# EAGLE design PRoMo_Base_DIP (EAGLE 6.4)
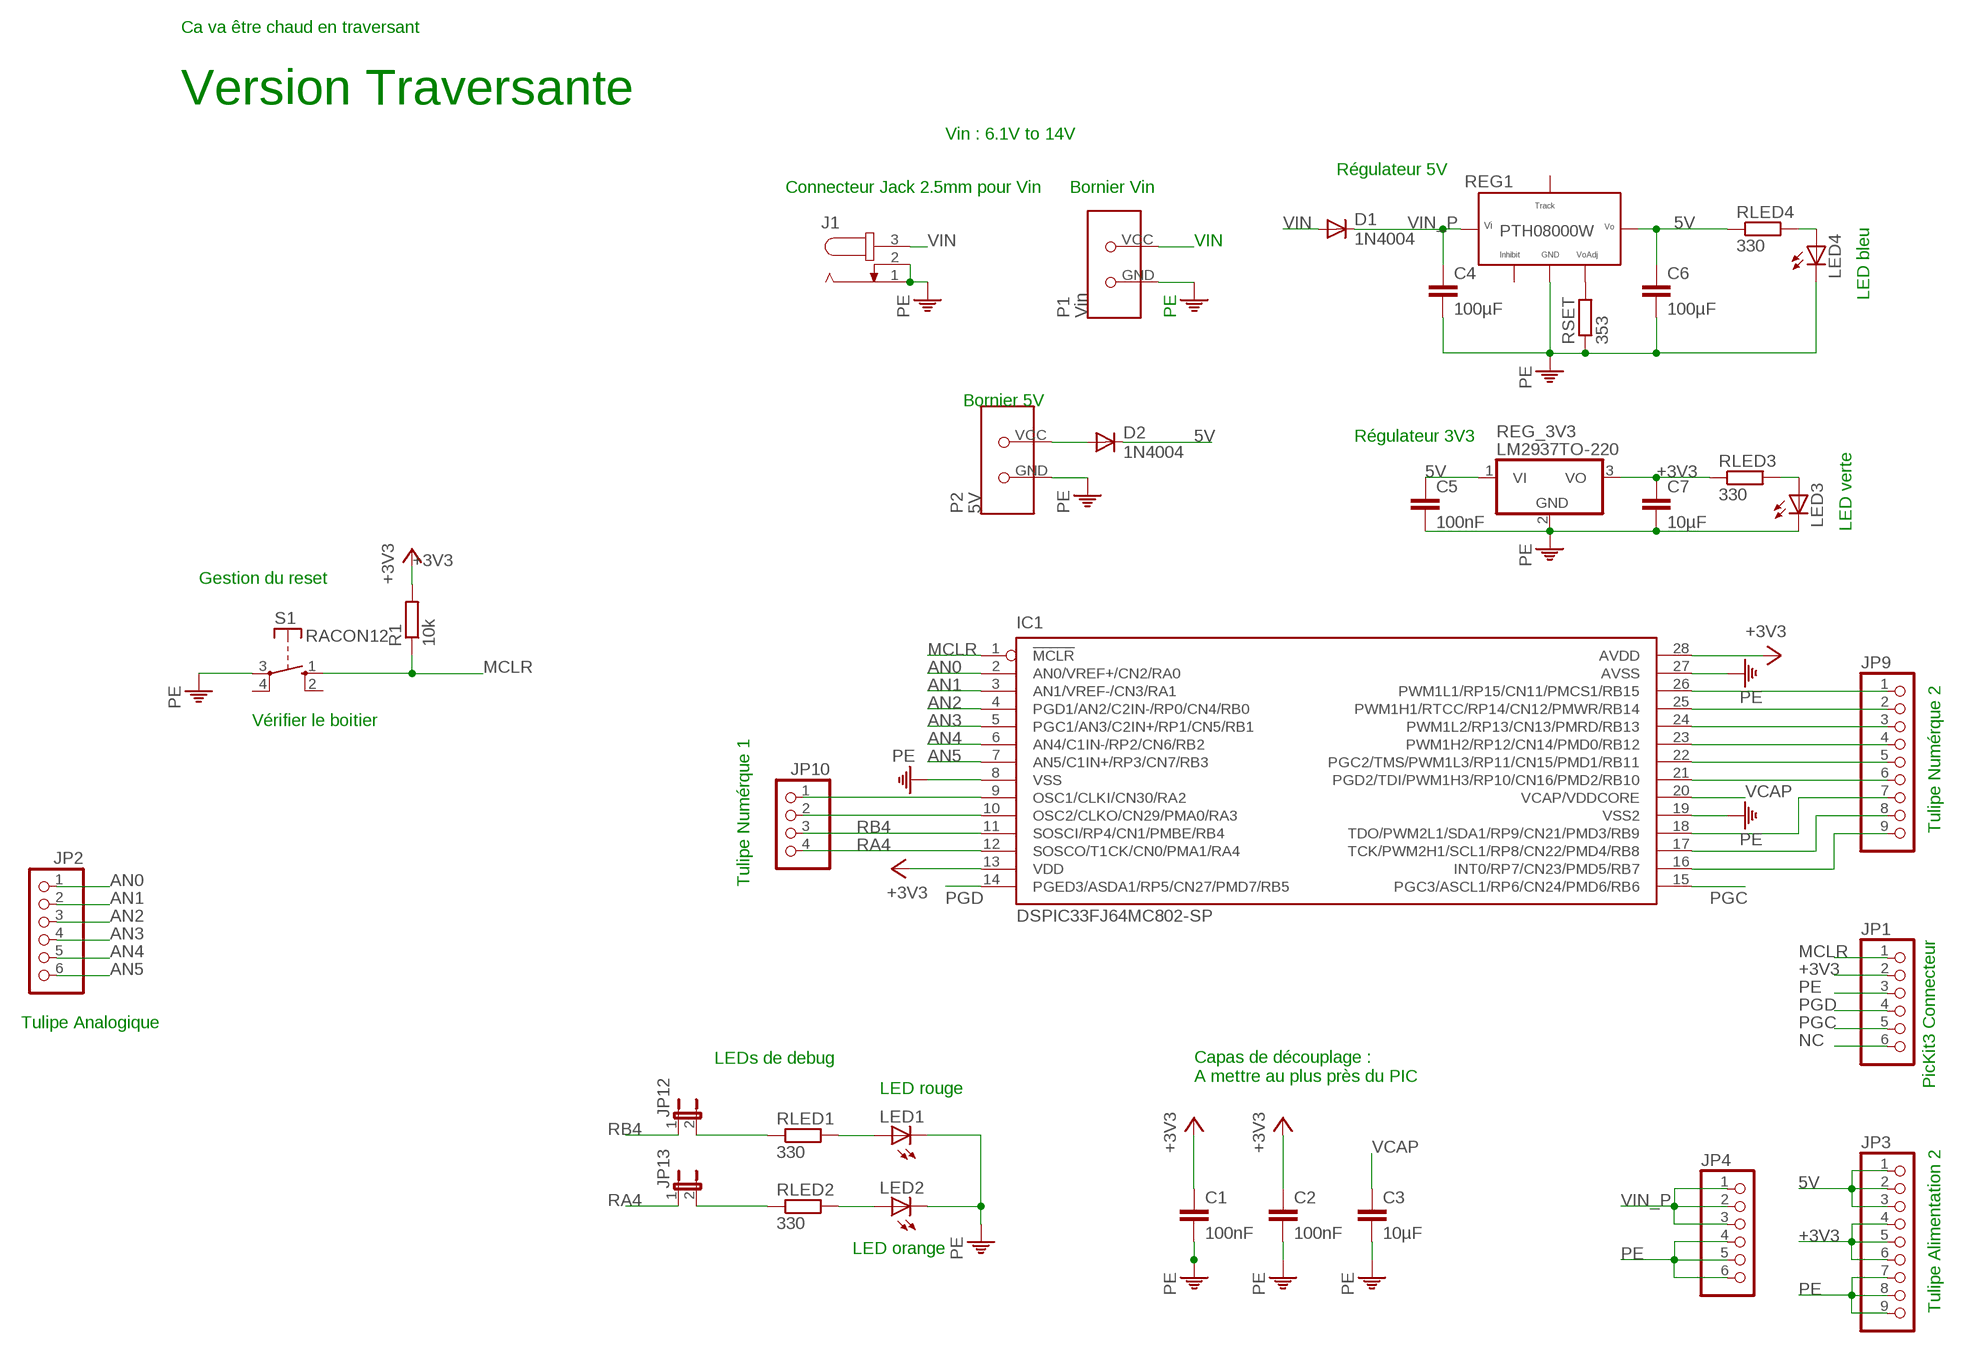
[diagram p0: schematic, sheet 1]

## Parts
C1  100nF  C-EU102-043X133  [C102-043X133]
C2  100nF  C-EU050-035X075  [C050-035X075]
C3  10µF  C-EU050-035X075  [C050-035X075]
C4  100µF  C-EU050-035X075  [C050-035X075]
C5  100nF  C-EU050-035X075  [C050-035X075]
C6  100µF  C-EU050-035X075  [C050-035X075]
C7  10µF  C-EU050-035X075  [C050-035X075]
D1  1N4004  [DO41-10]
D2  1N4004  [DO41-10]
IC1  DSPIC33FJ64MC802-SP  [DIL28-3]
J1  JACK-PLUG1  [SPC4078]
JP1  PINHD-1X6/90  [1X06/90]
JP2  PINHD-1X6  [1X06]
JP3  PINHD-1X9  [1X09]
JP4  PINHD-1X6  [1X06]
JP9  PINHD-1X9  [1X09]
JP10  PINHD-1X4  [1X04]
JP12  JP1E  [JP1]
JP13  JP1E  [JP1]
LED1  LED3MM  [LED3MM]
LED2  LED3MM  [LED3MM]
LED3  LED3MM  [LED3MM]
LED4  LED3MM  [LED3MM]
P1  Vin  BORNIER_3.5MM  [BORNIER_COUDEE_3.5]
P2  5V  BORNIER_3.5MM  [BORNIER_COUDEE_3.5]
R1  10k  R-EU_0204/7  [0204/7]
REG1  PTH08000W(EUS)  [TRHOUGH_HOLE_(EUS)]
REG_3V3  LM2937TO-220  [TO220V]
RLED1  330  R-EU_0204/7  [0204/7]
RLED2  330  R-EU_0204/7  [0204/7]
RLED3  330  R-EU_0204/7  [0204/7]
RLED4  330  R-EU_0204/7  [0204/7]
RSET  353  R-EU_0204/7  [0204/7]
S1  RACON12  [RACON12]

## Nets
5V: C5.1 C6.1 D2.C JP3.1 JP3.2 JP3.3 REG1.6 REG_3V3.1(VI) RLED4.1
+3V3: C1.1 C2.1 C7.1 IC1.13(VDD) IC1.28(AVDD) JP1.2 JP3.4 JP3.5 JP3.6 R1.2 REG_3V3.3(VO) RLED3.1
AN0: IC1.2(AN0/VREF+/CN2/RA0) JP2.1
AN1: IC1.3(AN1/VREF-/CN3/RA1) JP2.2
AN2: IC1.4(PGD1/AN2/C2IN-/RP0/CN4/RB0) JP2.3
AN3: IC1.5(PGC1/AN3/C2IN+/RP1/CN5/RB1) JP2.4
AN4: IC1.6(AN4/C1IN-/RP2/CN6/RB2) JP2.5
AN5: IC1.7(AN5/C1IN+/RP3/CN7/RB3) JP2.6
MCLR: IC1.1(!MCLR) JP1.1 R1.1 S1.1(S)
N$1: IC1.26(PWM1L1/RP15/CN11/PMCS1/RB15) JP9.1
N$2: IC1.25(PWM1H1/RTCC/RP14/CN12/PMWR/RB14) JP9.2
N$3: IC1.24(PWM1L2/RP13/CN13/PMRD/RB13) JP9.3
N$4: IC1.23(PWM1H2/RP12/CN14/PMD0/RB12) JP9.4
N$5: IC1.22(PGC2/TMS/PWM1L3/RP11/CN15/PMD1/RB11) JP9.5
N$6: IC1.21(PGD2/TDI/PWM1H3/RP10/CN16/PMD2/RB10) JP9.6
N$7: IC1.18(TDO/PWM2L1/SDA1/RP9/CN21/PMD3/RB9) JP9.7
N$8: IC1.17(TCK/PWM2H1/SCL1/RP8/CN22/PMD4/RB8) JP9.8
N$9: IC1.16(INT0/RP7/CN23/PMD5/RB7) JP9.9
N$10: IC1.9(OSC1/CLKI/CN30/RA2) JP10.1
N$11: IC1.10(OSC2/CLKO/CN29/PMA0/RA3) JP10.2
N$12: LED2.A RLED2.2
N$13: LED1.A RLED1.2
N$14: LED3.A RLED3.2
N$15: JP12.2 RLED1.1
N$16: JP13.2 RLED2.1
N$17: D2.A P2.VCC
N$20: REG1.5 RSET.2
N$21: LED4.A RLED4.2
NC: JP1.6
PE: C1.2 C2.2 C3.2 C4.2 C5.2 C6.2 C7.2 IC1.8(VSS) IC1.19(VSS2) IC1.27(AVSS) J1.1 J1.2 JP1.3 JP3.7 JP3.8 JP3.9 JP4.4 JP4.5 JP4.6 LED1.K(C) LED2.K(C) LED3.K(C) LED4.K(C) P1.GND P2.GND REG1.1 REG_3V3.2(GND) RSET.1 S1.3(P)
PGC: IC1.15(PGC3/ASCL1/RP6/CN24/PMD6/RB6) JP1.5
PGD: IC1.14(PGED3/ASDA1/RP5/CN27/PMD7/RB5) JP1.4
RA4: IC1.12(SOSCO/T1CK/CN0/PMA1/RA4) JP10.4 JP13.1
RB4: IC1.11(SOSCI/RP4/CN1/PMBE/RB4) JP10.3 JP12.1
VCAP: C3.1 IC1.20(VCAP/VDDCORE)
VIN: D1.A J1.3 P1.VCC
VIN_P: C4.1 D1.C JP4.1 JP4.2 JP4.3 REG1.3
Unconnected: REG1.2 REG1.4 S1.2(S) S1.4(P)

## Notes on the sheet
- Ca va être chaud en traversant
- Version Traversante
- Vin : 6.1V to 14V
- Régulateur 5V
- Connecteur Jack 2.5mm pour Vin | Bornier Vin
- LED bleu
- Bornier 5V
- Régulateur 3V3
- LED verte
- Gestion du reset
- Vérifier le boitier
- Tulipe Numérque 2
- Tulipe Numérque 1
- PicKit3 Connecteur
- Tulipe Analogique
- LEDs de debug
- LED rouge
- Capas de découplage :
  A mettre au plus près du PIC
- LED orange
- Tulipe Alimentation 2

## Library data of the parts
C1-C7 = rcl:C-EU: CAPACITOR, European symbol
D1 D2 = diode:1N4004: DIODE general purpose rectifier, 1 A
IC1 = microchip-dspic33fjxxmc:DSPIC33FJ64MC802: High-Performance, 16-bit Digital Signal Controllers - dsPIC33FJ32MC302/304, dsPIC33FJ64MCX02/X04, AND dsPIC33FJ128MCX02/X04 Package: 28-Pin SDIP, SOIC, QFN-S Operating Range: . Up to 40 MIPS operation (at 3.0-3.6V): - Industrial temperature range (-40°C to +85°C) - Extended temperature range (-40°C to +125°C) High-Performance DSC CPU: . Modified Harvard architecture . C compiler optimized instruction set . 16-bit wide data path . 24-bit wide instructions . Linear program memory addressing up to 4M instruction words . Linear data memory addressing up to 64 Kbytes . 83 base instructions: mostly 1 word/1 cycle . Two 40-bit accumulators with rounding and saturation options . Flexible and powerful addressing modes: - Indirect - Modulo - Bit-Reversed . Software stack . 16 x 16 fractional/integer multiply operations . 32/16 and 16/16 divide operations . Single-cycle multiply and accumulate: - Accumulator write back for DSP operations - Dual data fetch . Up to ±16-bit shifts for up to 40-bit data On-Chip Flash and SRAM: . Flash program memory . Data SRAM . Boot, Secure, and General Security for program Flash Direct Memory Access (DMA): . 8-channel hardware DMA . Up to 2 Kbytes dual ported DMA buffer area (DMA RAM) to store data transferred via DMA: - Allows data transfer between RAM and a peripheral while CPU is executing code (no cycle stealing) . Most peripherals support DMA Timers/Capture/Compare/PWM: . Timer/Counters, up to five 16-bit timers: - Can pair up to make two 32-bit timers - One timer runs as a Real-Time Clock with an external 32.768 kHz oscillator - Programmable prescaler . Input Capture (up to four channels): - Capture on up, down or both edges - 16-bit capture input functions - 4-deep FIFO on each capture . Output Compare (up to four channels): - Single or Dual 16-bit Compare mode - 16-bit Glitchless PWM mode . Hardware Real-Time Clock/Calendar (RTCC): - Provides clock, calendar, and alarm functions Interrupt Controller: . 5-cycle latency . 118 interrupt vectors . Up to 49 available interrupt sources . Up to three external interrupts . Seven programmable priority levels . Five processor exceptions Digital I/O: . Peripheral pin Select functionality . Up to 35 programmable digital I/O pins . Wake-up/Interrupt-on-Change for up to 21 pins . Output pins can drive from 3.0V to 3.6V . Up to 5V output with open drain configuration . All digital input pins are 5V tolerant . 4 mA sink on all I/O pins System Management: . Flexible clock options: - External, crystal, resonator, internal RC - Fully integrated Phase-Locked Loop (PLL) - Extremely low jitter PLL . Power-up Timer . Oscillator Start-up Timer/Stabilizer . Watchdog Timer with its own RC oscillator . Fail-Safe Clock Monitor . Reset by multiple sources Power Management: . On-chip 2.5V voltage regulator . Switch between clock sources in real time . Idle, Sleep, and Doze modes with fast wake-up Analog-to-Digital Converters (ADCs): . 10-bit, 1.1 Msps or 12-bit, 500 Ksps conversion: - Two and four simultaneous samples (10-bit ADC) - Up to 13 input channels with auto-scanning - Conversion start can be manual or synchronized with one of four trigger sources - Conversion possible in Sleep mode - ±2 LSb max integral nonlinearity - ±1 LSb max differential nonlinearity Audio Digital-to-Analog Converter (DAC): . 16-bit Dual Channel DAC module . 100 Ksps maximum sampling rate . Second-Order Digital Delta-Sigma Modulator Data Converter Interface (DCI) module: . Codec interface . Supports I2S and AC.97 protocols . Up to 16-bit data words, up to 16 words per frame . 4-word deep TX and RX buffers Comparator Module: . Two analog comparators with programmable input/output configuration CMOS Flash Technology: . Low-power, high-speed Flash technology . Fully static design . 3.3V (±10%) operating voltage . Industrial and Extended temperature . Low power consumption Communication Modules: . 4-wire SPI (up to two modules): - Framing supports I/O interface to simple codecs - Supports 8-bit and 16-bit data - Supports all serial clock formats and sampling modes . I2C?: - Full Multi-Master Slave mode support - 7-bit and 10-bit addressing - Bus collision detection and arbitration - Integrated signal conditioning - Slave address masking . UART (up to two modules): - Interrupt on address bit detect - Interrupt on UART error - Wake-up on Start bit from Sleep mode - 4-character TX and RX FIFO buffers - LIN bus support - IrDA® encoding and decoding in hardware - High-Speed Baud mode - Hardware Flow Control with CTS and RTS . Enhanced CAN (ECAN. module) 2.0B active: - Up to eight transmit and up to 32 receive buffers - 16 receive filters and three masks - Loopback, Listen Only and Listen All - Messages modes for diagnostics and bus monitoring - Wake-up on CAN message - Automatic processing of Remote Transmission Requests - FIFO mode using DMA - DeviceNet. addressing support . Parallel Master Slave Port (PMP/EPSP): - Supports 8-bit or 16-bit data - Supports 16 address lines . Programmable Cyclic Redundancy Check (CRC): - Programmable bit length for the CRC generator polynomial (up to 16-bit length) - 8-deep, 16-bit or 16-deep, 8-bit FIFO for data input
J1 = con-jack:JACK-PLUG: DC POWER JACK Power Jack, DC, Right Angle, Through Hole, Rated 5A at 16VDC, PC Terminals Distributor: Farnell (www.Farnell.de) Drawing: 84N1161.pdf / 84N1162.pdf Manufacturer: SPC Technology (www.spctechnology.com) Type: SPC4077 / SPC 4078; OC_FARNELL: unknown; OC_NEWARK: unknown
JP1 JP2 JP4 = pinhead:PINHD-1X6: PIN HEADER
JP3 JP9 = pinhead:PINHD-1X9: PIN HEADER
JP10 = pinhead:PINHD-1X4: PIN HEADER
JP12 JP13 = jumper:JP1E: JUMPER
LED1-LED4 = led:LED: LED OSRAM: - CHIPLED LG R971, LG N971, LY N971, LG Q971, LY Q971, LO R971, LY R971 LH N974, LH R974 LS Q976, LO Q976, LY Q976 LO Q996 - Hyper CHIPLED LW Q18S LB Q993, LB Q99A, LB R99A - SideLED LS A670, LO A670, LY A670, LG A670, LP A670 LB A673, LV A673, LT A673, LW A673 LH A674 LY A675 LS A676, LA A676, LO A676, LY A676, LW A676 LS A679, LY A679, LG A679 - Hyper Micro SIDELED® LS Y876, LA Y876, LO Y876, LY Y876 LT Y87S - SmartLED LW L88C, LW L88S LB L89C, LB L89S, LG L890 LS L89K, LO L89K, LY L89K LS L896, LA L896, LO L896, LY L896 - TOPLED LS T670, LO T670, LY T670, LG T670, LP T670 LSG T670, LSP T670, LSY T670, LOP T670, LYG T670 LG T671, LOG T671, LSG T671 LB T673, LV T673, LT T673, LW T673 LH T674 LS T676, LA T676, LO T676, LY T676, LB T676, LH T676, LSB T676, LW T676 LB T67C, LV T67C, LT T67C, LS T67K, LO T67K, LY T67K, LW E67C LS E67B, LA E67B, LO E67B, LY E67B, LB E67C, LV E67C, LT E67C LW T67C LS T679, LY T679, LG T679 LS T770, LO T770, LY T770, LG T770, LP T770 LB T773, LV T773, LT T773, LW T773 LH T774 LS E675, LA E675, LY E675, LS T675 LS T776, LA T776, LO T776, LY T776, LB T776 LHGB T686 LT T68C, LB T68C - Hyper Mini TOPLED® LB M676 - Mini TOPLED Santana® LG M470 LS M47K, LO M47K, LY M47K Source: http://www.osram.convergy.de LUXEON: - LUMILED® LXK2-PW12-R00, LXK2-PW12-S00, LXK2-PW14-U00, LXK2-PW14-V00 LXK2-PM12-R00, LXK2-PM12-S00, LXK2-PM14-U00 LXK2-PE12-Q00, LXK2-PE12-R00, LXK2-PE12-S00, LXK2-PE14-T00, LXK2-PE14-U00 LXK2-PB12-K00, LXK2-PB12-L00, LXK2-PB12-M00, LXK2-PB14-N00, LXK2-PB14-P00, LXK2-PB14-Q00 LXK2-PR12-L00, LXK2-PR12-M00, LXK2-PR14-Q00, LXK2-PR14-R00 LXK2-PD12-Q00, LXK2-PD12-R00, LXK2-PD12-S00 LXK2-PH12-R00, LXK2-PH12-S00 LXK2-PL12-P00, LXK2-PL12-Q00, LXK2-PL12-R00 Source: www.luxeon.com KINGBRIGHT: KA-3528ASYC Source: www.kingbright.com
P1 P2 = Perso:BORNIER_3.5MM: Bornier 3.5mm Bornier emfichable 3.5mm coudée
R1 RLED1-RLED4 RSET = rcl:R-EU_: RESISTOR, European symbol
REG1 = Perso:PTH08000W(EUS): PTH08000H Alimentation à découpage : Vin : 4.5V to 14V Vout : 0.9V to 5.5V Iout : 2.25A
REG_3V3 = linear:LM2937: LM2937-2.5, LM2937-3.3 400mA and 500mA Voltage Regulators Source: http://cache.national.com/ds/LM/LM2937-2.5.pdf
S1 = switch-misc:RACON12: ITT SWITCH

## Board
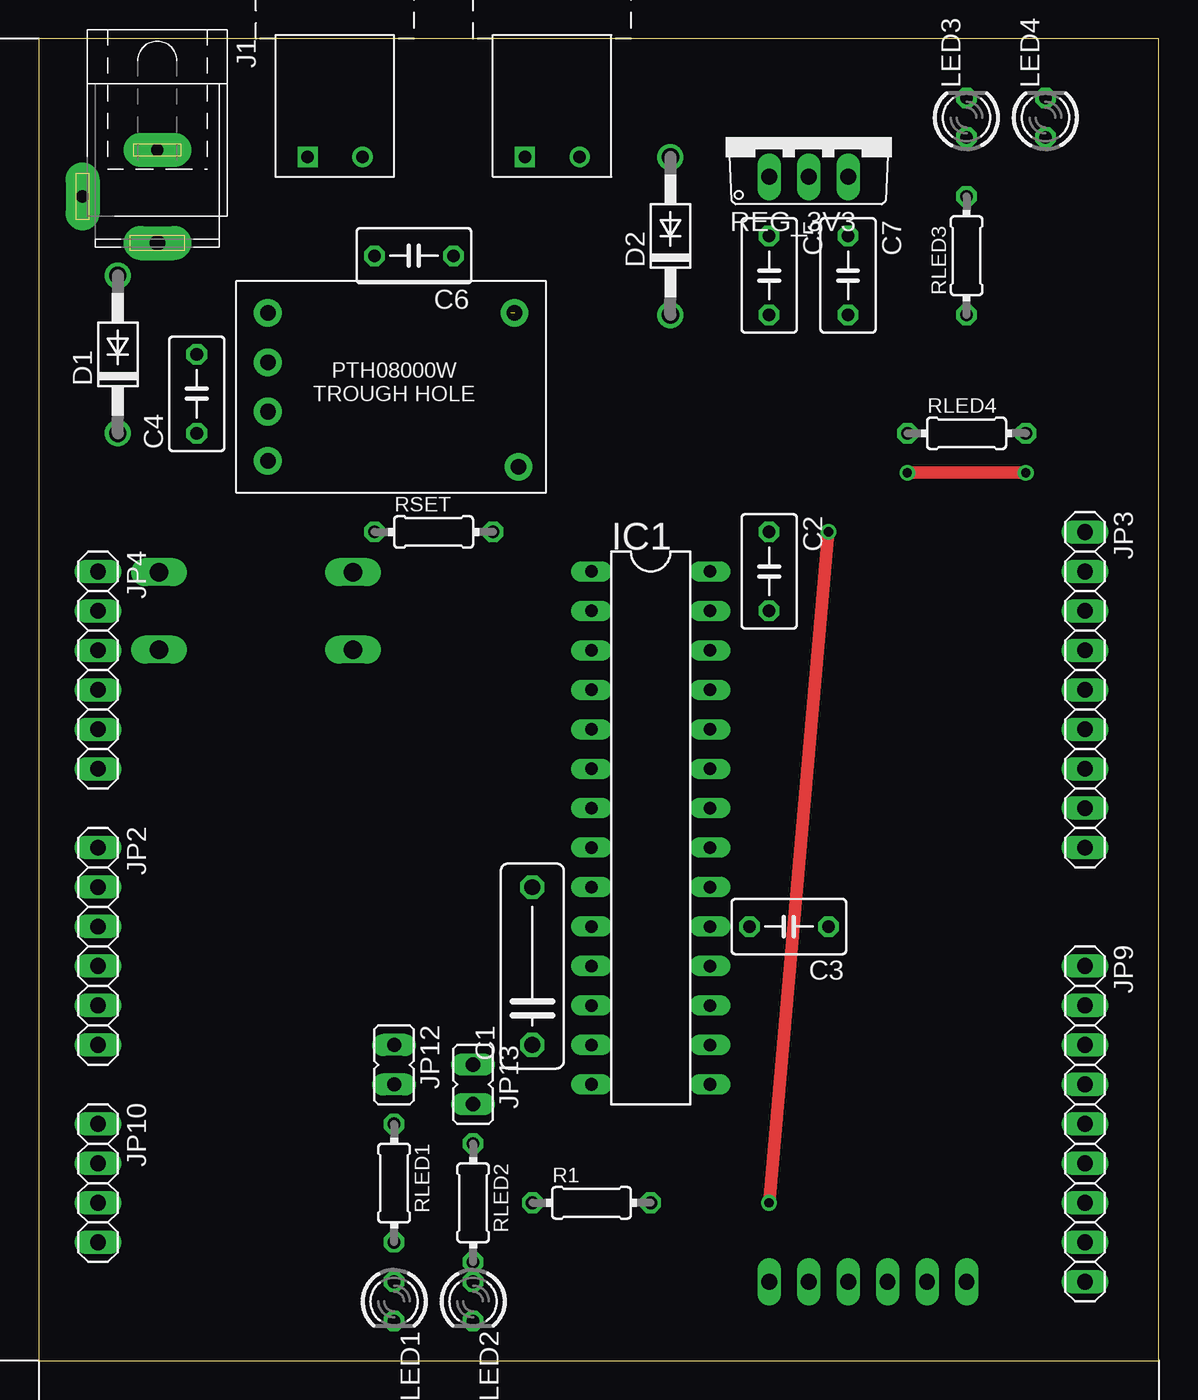
[diagram p1: board, top side]
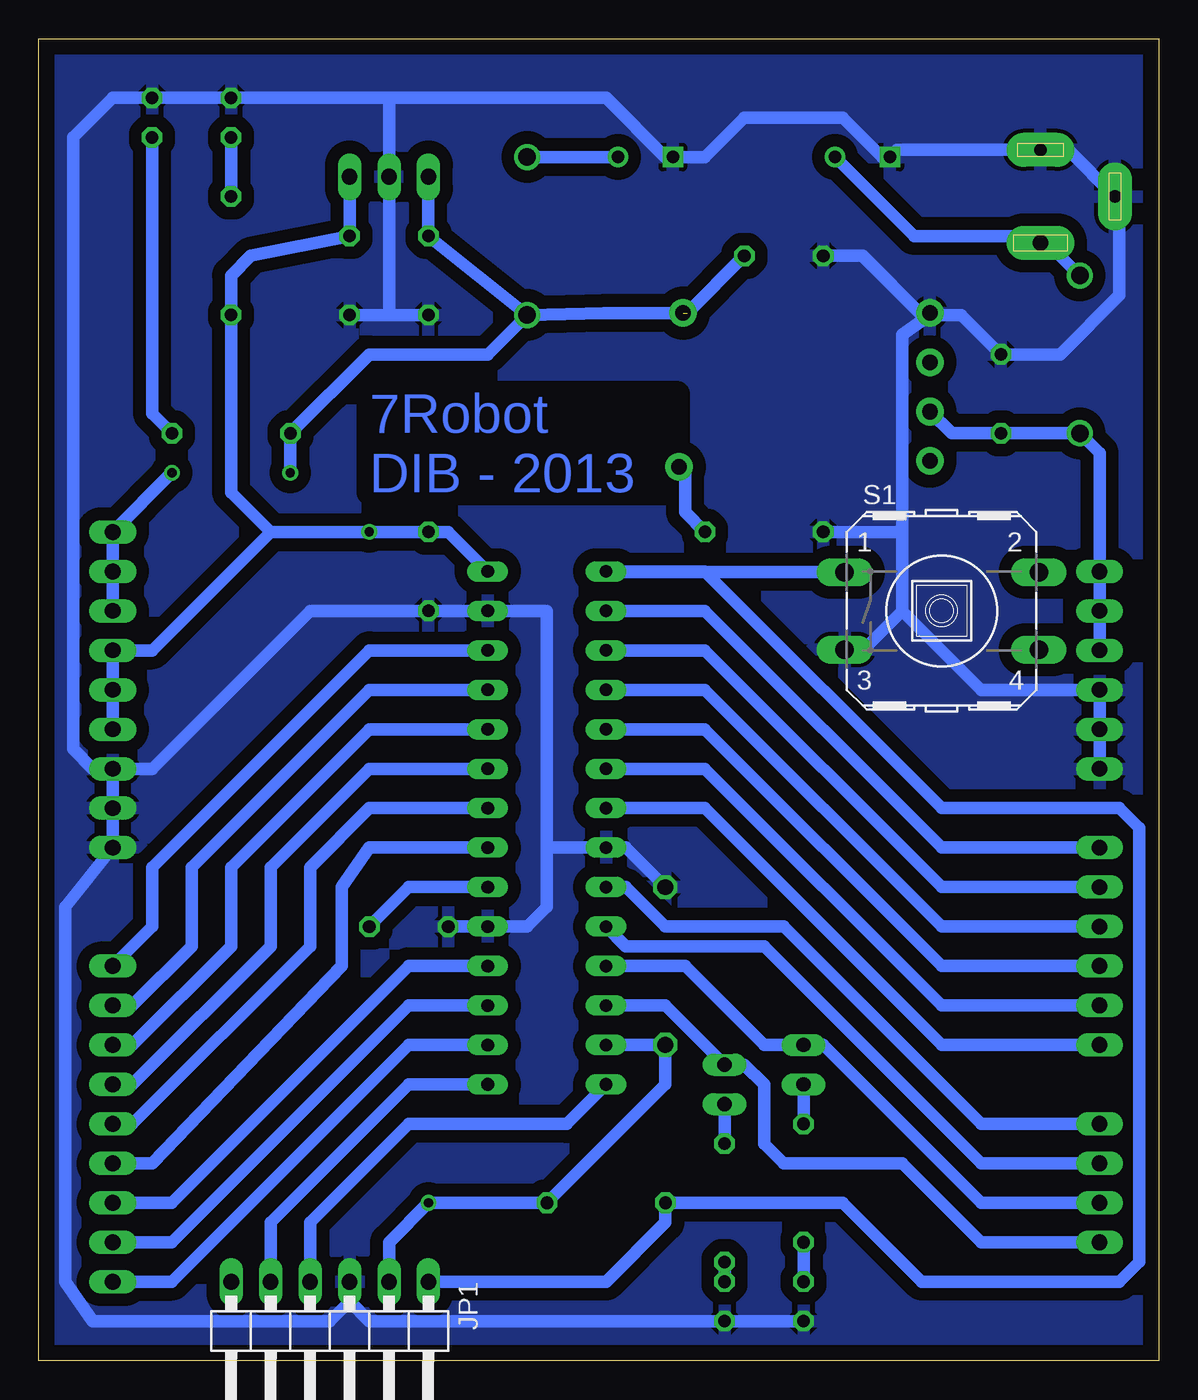
[diagram p2: board, bottom side, seen from below]

Size 72.06 x 85.08 mm. Coordinates in mm from the lower left corner, seen from the top.
Outline: 0,0 72.06,0 72.06,85.08 0,85.08 0,0
Copper layers (1*16): Top 0.035mm / dielectric 1.5mm / Bottom 0.035mm
Design rules "default": minimum track width 10mil, minimum drill 24mil, track to track 8mil, track to pad 8mil, pad to pad 8mil, via to via 8mil, smd to smd 8mil, copper to edge 40mil, drill to drill 8mil, minimum pad ring 10mil, minimum via ring 8mil, stop-mask expansion 4mil, vias tented up to drill 0mil, thermal gap 10mil

### Footprints (pad centres in the part's own frame; a part is rotated, then mirrored left to right if it is on the bottom)
C102-043X133 = drill 1.016 octagon: 1 -5.08,0; 2 5.08,0
C050-035X075 = drill 0.813 octagon: 1 -2.54,0; 2 2.54,0
DO41-10 = drill 1.118: A 5.08,0; C -5.08,0
DIL28-3 = drill 0.813 long: 1 -16.51,-3.81; 2 -13.97,-3.81; 3 -11.43,-3.81; 4 -8.89,-3.81; 5 -6.35,-3.81; 6 -3.81,-3.81; 7 -1.27,-3.81; 8 1.27,-3.81; 9 3.81,-3.81; 10 6.35,-3.81; 11 8.89,-3.81; 12 11.43,-3.81; 13 13.97,-3.81; 14 16.51,-3.81; 15 16.51,3.81; 16 13.97,3.81; 17 11.43,3.81; 18 8.89,3.81; 19 6.35,3.81; 20 3.81,3.81; 21 1.27,3.81; 22 -1.27,3.81; 23 -3.81,3.81; 24 -6.35,3.81; 25 -8.89,3.81; 26 -11.43,3.81; 27 -13.97,3.81; 28 -16.51,3.81
SPC4078 = drill 0.8 pad 2.184 long: 1 -3,0; 2 0,-4.8 | drill 1 pad 2.184 long: 3 3,0
1X06/90 = drill 1.016 long: 1 -6.35,-3.81; 2 -3.81,-3.81; 3 -1.27,-3.81; 4 1.27,-3.81; 5 3.81,-3.81; 6 6.35,-3.81
1X06 = drill 1.016 long: 1 -6.35,0; 2 -3.81,0; 3 -1.27,0; 4 1.27,0; 5 3.81,0; 6 6.35,0
1X09 = drill 1.016 long: 1 -10.16,0; 2 -7.62,0; 3 -5.08,0; 4 -2.54,0; 5 0,0; 6 2.54,0; 7 5.08,0; 8 7.62,0; 9 10.16,0
1X04 = drill 1.016 long: 1 -3.81,0; 2 -1.27,0; 3 1.27,0; 4 3.81,0
JP1 = drill 0.914 long: 1 0,-1.27; 2 0,1.27
LED3MM = drill 0.813 octagon: A -1.27,0; K 1.27,0
BORNIER_COUDEE_3.5 = drill 0.8 square: GND 2.057,1.27 | drill 0.8: VCC 5.588,1.27
0204/7 = drill 0.813 octagon: 1 -3.81,0; 2 3.81,0
TRHOUGH_HOLE_(EUS) = drill 1 pad 1.778: 1 2.032,11.557; 2 2.032,8.382; 3 2.032,5.207; 4 2.032,2.032; 5 18.161,1.651; 6 17.907,11.557
TO220V = drill 1.016 long: 1 -2.54,-2.54; 2 0,-2.54; 3 2.54,-2.54
RACON12 = drill 1.194 long: 1 -6.248,2.489; 2 6.248,2.489; 3 -6.248,-2.489; 4 6.248,-2.489

### Placement (x,y rotation side)
C1  31.75,25.4 90 top
C2  46.99,50.8 270 top
C3  48.26,27.94 180 top
C4  10.16,62.23 90 top
C5  46.99,69.85 270 top
C6  24.13,71.12 180 top
C7  52.07,69.85 270 top
D1  5.08,64.77 90 top
D2  40.64,72.39 90 top
IC1  39.37,34.29 270 top
J1  7.62,74.93 270 top
JP1  53.34,1.27 180 bottom
JP2  3.81,26.67 270 top
JP3  67.31,43.18 270 top
JP4  3.81,44.45 270 top
JP9  67.31,15.24 270 top
JP10  3.81,11.43 270 top
JP12  22.86,19.05 180 top
JP13  27.94,17.78 180 top
LED1  22.86,3.81 270 top
LED2  27.94,3.81 270 top
LED3  59.69,80.01 90 top
LED4  64.77,80.01 90 top
P1  15.24,76.2 0 top
P2  29.21,76.2 0 top
R1  35.56,10.16 0 top
REG1  12.7,55.88 0 top
REG_3V3  49.53,78.74 0 top
RLED1  22.86,11.43 270 top
RLED2  27.94,10.16 270 top
RLED3  59.69,71.12 90 top
RLED4  59.69,59.69 0 top
RSET  25.4,53.34 0 top
S1  13.97,48.26 0 bottom

### Tracks (layer width: path | path; a pad name or v marks a point on that pad's centre or on a via)
5V  (via drill 0.6)  (2 unrouted)
  Top 0.813: v55.88,57.15 63.5,57.15
  Bottom 0.813: JP3.3 JP3.2 JP3.1 63.5,57.15 | C6.1 30.35,67.44 35.69,67.44 D2.C | D2.C C5.1 REG_3V3.1 | v55.88,57.15 RLED4.1 50.8,64.77 43.18,64.77 D2.C
+3V3  (via drill 0.6)
  Top 0.813: v50.8,53.34 v46.99,10.16
  Bottom 0.813: IC1.13 C1.1 31.75,17.78 R1.2 v46.99,10.16 49.53,7.62 JP1.2 | JP3.6 JP3.5 JP3.4 64.77,45.72 57.15,53.34 | 57.15,53.34 v50.8,53.34 C2.1 45.72,53.34 IC1.28 | REG_3V3.3 C7.1 58.42,71.12 59.69,69.85 RLED3.1 59.69,55.88 57.15,53.34
AN0
  Bottom 0.813: IC1.2 29.21,48.26 13.97,33.02 JP2.1
AN1
  Bottom 0.813: IC1.3 29.21,45.72 13.97,30.48 JP2.2
AN2
  Bottom 0.813: JP2.3 13.97,27.94 29.21,43.18 IC1.4
AN3
  Bottom 0.813: IC1.5 29.21,40.64 13.97,25.4 JP2.4
AN4
  Bottom 0.813: IC1.6 29.21,38.1 13.97,22.86 JP2.5
AN5
  Bottom 0.813: JP2.6 13.97,20.32 29.21,35.56 IC1.7
MCLR
  Bottom 0.813: JP1.1 35.56,5.08 31.75,8.89 R1.1 20.32,10.16 15.24,5.08 2.54,5.08 1.27,6.35 1.27,34.29 2.54,35.56 13.97,35.56 29.21,50.8 IC1.1 35.51,50.75 S1.1
N$1
  Bottom 0.813: JP9.1 64.77,27.94 64.77,31.75 50.8,45.72 IC1.26
N$2
  Bottom 0.813: JP9.2 66.04,22.86 62.23,26.67 62.23,31.75 50.8,43.18 IC1.25
N$3
  Bottom 0.813: JP9.3 66.04,20.32 59.69,26.67 59.69,31.75 50.8,40.64 IC1.24
N$4
  Bottom 0.813: JP9.4 66.04,17.78 57.15,26.67 57.15,31.75 50.8,38.1 IC1.23
N$5
  Bottom 0.813: JP9.5 66.04,15.24 54.61,26.67 54.61,31.75 50.8,35.56 IC1.22
N$6
  Bottom 0.813: JP9.6 64.77,12.7 52.58,25.4 52.58,30.48 50.8,33.02 IC1.21
N$7
  Bottom 0.813: JP9.7 63.5,10.16 48.26,25.4 IC1.18
N$8
  Bottom 0.813: JP9.8 63.5,7.62 48.26,22.86 IC1.17
N$9
  Bottom 0.813: JP9.9 63.5,5.08 48.26,20.32 IC1.16
N$10
  Bottom 0.813: IC1.9 34.29,30.48 31.75,27.94 24.13,27.94 11.43,15.24 JP10.1
N$11
  Bottom 0.813: IC1.10 34.29,26.67 25.4,26.67 11.43,12.7 JP10.2
N$12
  Bottom 0.813: RLED2.2 LED2.A
N$13
  Bottom 0.813: RLED1.2 LED1.A
N$14
  Bottom 0.813: LED3.A RLED3.2
N$15
  Bottom 0.813: JP12.2 RLED1.1
N$16
  Bottom 0.813: JP13.2 RLED2.1
N$17
  Bottom 0.813: P2.VCC D2.A
N$18  (via drill 0.6)
  other vias: 63.5,57.15
N$20
  Bottom 0.813: RSET.2 30.48,54.61 30.48,57.15 REG1.5
N$21
  Bottom 0.813: LED4.A 64.77,60.96 RLED4.2
PE
  Bottom 0.813: 15.07,67.07 16.51,66.04 16.51,53.34 | 15.07,67.07 14.73,67.31 REG1.1 14.61,67.31 | C3.2 IC1.19 40.64,27.94 39.37,29.21 39.37,33.02 | 39.37,33.02 IC1.8 34.29,33.02 C1.2 | 52.07,3.81 50.8,2.54 LED2.K LED1.K | JP3.7 JP3.8 JP3.9 70.36,29.21 70.36,5.08 68.58,2.54 53.34,2.54 52.07,3.81 | JP4.6 JP4.5 JP4.4 11.43,43.18 16.51,48.26 | S1.3 19,45.77 16.51,48.26 | 16.51,48.26 16.51,53.34 | 39.37,33.02 39.37,48.26 IC1.27 C2.2 54.61,48.26 64.77,38.1 JP3.7 | JP1.3 52.07,3.81 | RSET.1 16.51,53.34 | C6.2 19.05,71.12 | 19.05,71.12 19.05,71.05 15.07,67.07 | 49.53,67.31 REG_3V3.2 49.53,81.28 | C5.2 49.53,67.31 | C7.2 49.53,67.31 | 49.53,81.28 35.56,81.28 31.75,77.47 P2.GND 29.21,77.47 26.67,80.01 20.32,80.01 17.78,77.47 P1.GND 16.84,77.93 J1.1 5.82,77.93 J1.2 2.54,74.65 2.54,68.58 6.35,64.77 C4.2 12.7,67.31 14.61,67.31 | 49.53,81.28 LED3.K LED4.K 67.31,81.28 69.85,78.74 69.85,39.37 68.58,38.1 JP3.7 | 19.05,71.12 15.24,67.31 14.61,67.31
  pour Bottom (isolate 0.813): 0,0 72.39,0 72.39,85.09 0,85.09
PGC
  Bottom 0.813: IC1.15 48.26,17.78 57.15,8.89 JP1.5
PGD
  Bottom 0.813: IC1.14 38.1,15.24 48.26,15.24 54.61,8.89 JP1.4
RA4
  Bottom 0.813: IC1.12 31.75,22.86 JP13.1 26.67,19.05 25.4,17.78 25.4,13.97 24.13,12.7 16.51,12.7 11.43,7.62 JP10.4
RB4
  Bottom 0.813: IC1.11 30.48,25.4 25.4,20.32 JP12.1 21.59,20.32 11.43,10.16 JP10.3
VCAP
  Bottom 0.813: C3.1 48.26,30.48 IC1.20
VIN
  Bottom 0.813: 7.62,72.39 J1.3 | D1.A 7.62,72.39 | 7.62,72.39 15.75,72.39 P1.VCC
VIN_P
  Bottom 0.813: D1.C C4.1 | JP4.3 JP4.2 JP4.1 3.81,58.42 D1.C | D1.C 13.34,59.69 REG1.3

### Text on the board
Bottom: 7Robot / DIB - 2013
tNames: Carte de DEV dsPIC33 : / V1.0 / Base du kit de dev | Vérifier l'emprunte du BP